# EAGLE design Hall Effect Power (EAGLE 7.6.0)
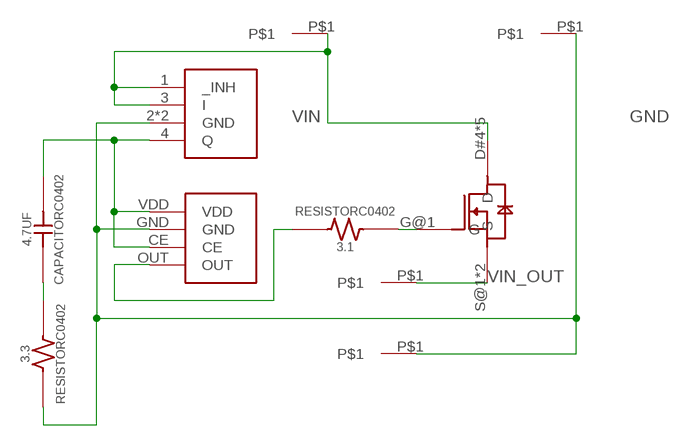
[diagram p0: schematic, sheet 1]

## Parts
3.1  RESISTORC0402  [C0402]
3.3  RESISTORC0402  [C0402]
4.7UF  CAPACITORC0402  [C0402]
U$1  HALL-MOSFET-NEW  [HALL-MOSFET-NEW]
U$2  HALL-HALL-NEW  [HALL-HALL-NEW]
U$3  HALL-REG-NEW  [HALL-REG-NEW]
U$4  SINGLE-WIRE  [SINGLE-WIRE]
U$5  SINGLE-WIRE  [SINGLE-WIRE]
U$6  SINGLE-WIRE  [SINGLE-WIRE]
U$7  SINGLE-WIRE  [SINGLE-WIRE]

## Nets
GND: 3.3.1 U$2.GND U$3.2(GND) U$3.5(GND) U$4.P$1 U$7.P$1
HALL_OUT: 3.1.2 U$2.OUT
N$1: 4.7UF.2(B) U$2.CE U$2.VDD U$3.4(Q)
N$2: 3.3.2 4.7UF.1(A)
N$3: 3.1.1 U$1.G@1(G)
VIN: U$1.D#4(D) U$1.D@1(D) U$1.D@2(D) U$1.D@3(D) U$1.D@5(D) U$3.1(_INH) U$3.3(I) U$6.P$1
VIN_OUT: U$1.S@1(S) U$1.S@2(S) U$5.P$1

## Library data of the parts
3.1 = RocketControlBoard:RESISTOR: SMD Resistor; DESC: RES SMD 470 OHM 5% 1/16W 0402; DIGIKEY#: 1276-4368-1-ND; MANF: Samsung Electro-Mechanics America, Inc.; MANF#: RC1005J471CS
3.3 = RocketControlBoard:RESISTOR: SMD Resistor; DESC: RES SMD 3.3 OHM 5% 1/16W 0402; DIGIKEY#: 311-3.3JRCT-ND; MANF: Yageo; MANF#: RC0402JR-073R3L
4.7UF = RocketControlBoard:CAPACITOR: SMD Capacitor; DESC: CAP CER 4.7UF 10V X5R 0402; DIGIKEY#: 1276-6819-1-ND; MANF: Samsung Electro-Mechanics America, Inc.; MANF#: CL05A475MP7NRB8
U$1 = RocketControlBoard:HALL-MOSFET-NEW; DESC: MOSFET N-CH 40V 30A SC70-6; DIGIKEY#: SIAA40DJ-T1-GE3CT-ND; MANF: Vishay Siliconix; MANF#: SIAA40DJ-T1-GE3
U$2 = RocketControlBoard:HALL-HALL-NEW; DESC: IC HALL EFFECT SENSOR SNT-4A; DIGIKEY#: 1662-1657-1-ND; MANF: SII Semiconductor Corporation; MANF#: S-5724HCBL1-I4T1U
U$3 = RocketControlBoard:HALL-REG-NEW; DESC: IC REG LDO 3.3V 30MA SCT595-5; DIGIKEY#: IFX20001MBV33HTSA1CT-ND; MANF: Infineon Technologies; MANF#: IFX20001MBV33HTSA1
U$4-U$7 = RocketControlBoard:SINGLE-WIRE

## Board
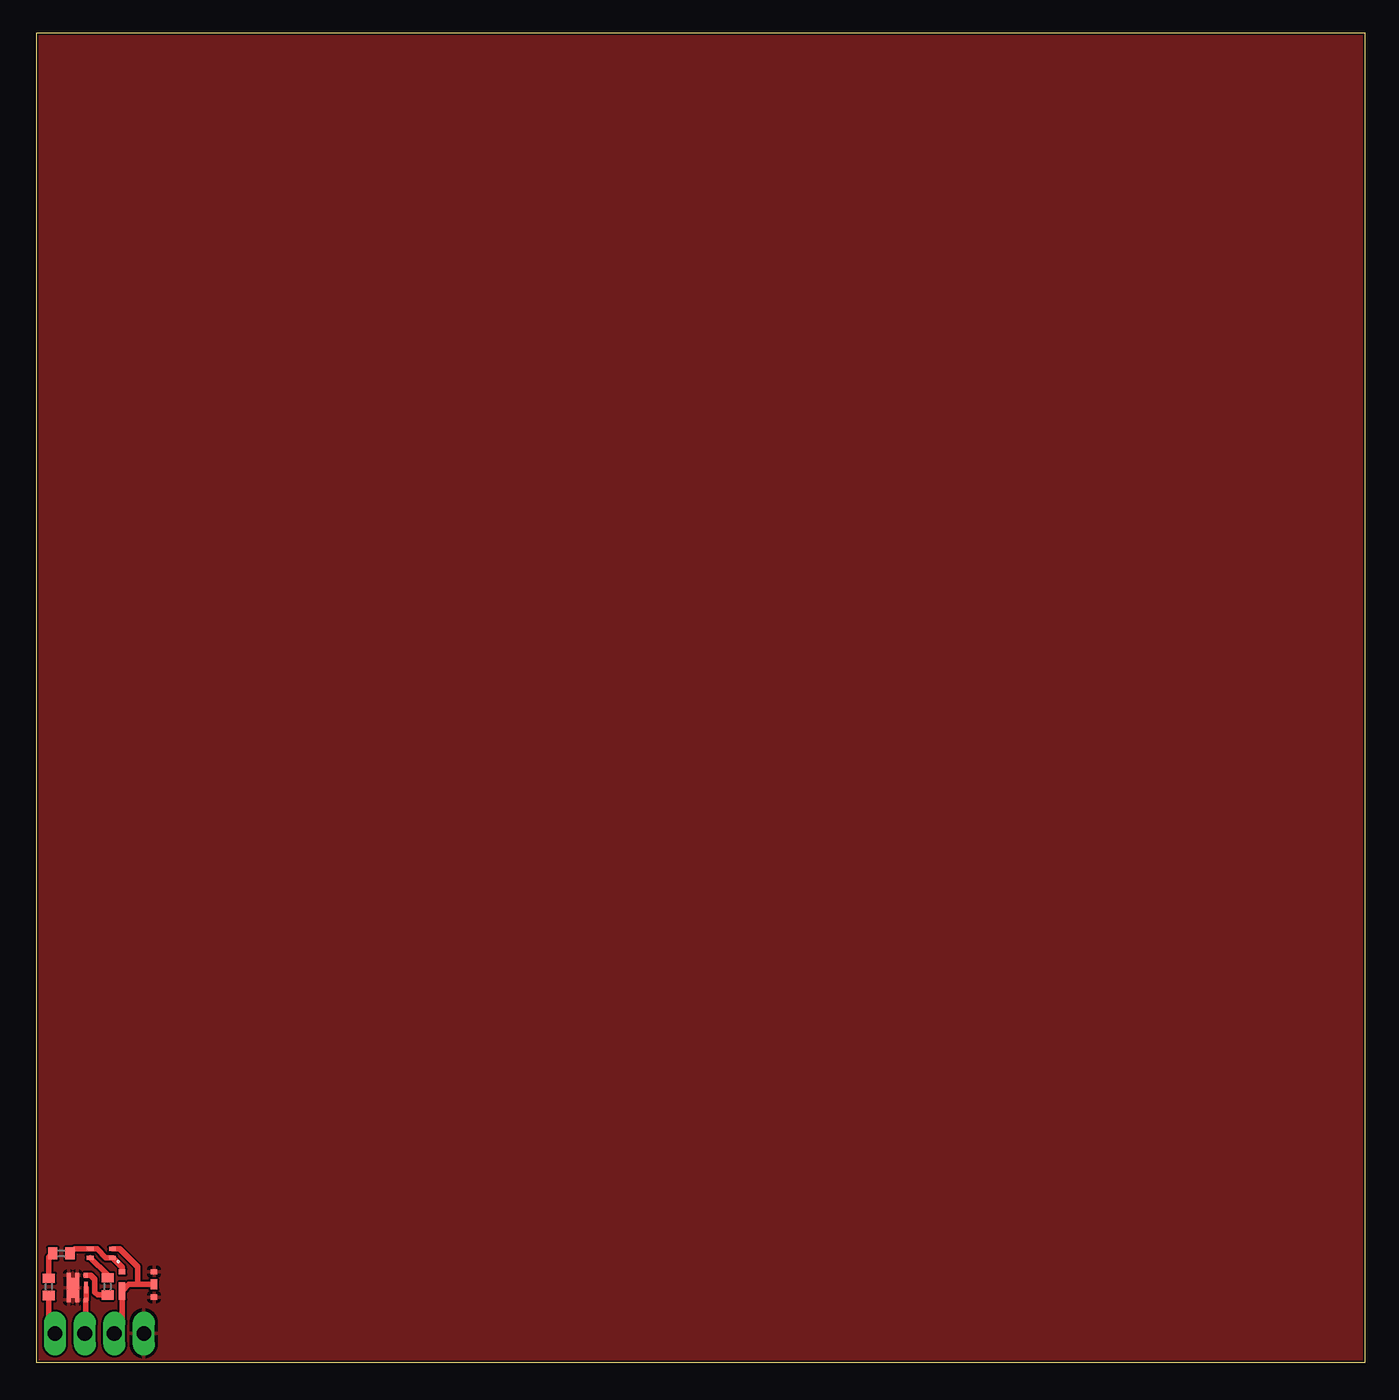
[diagram p1: board, top side]
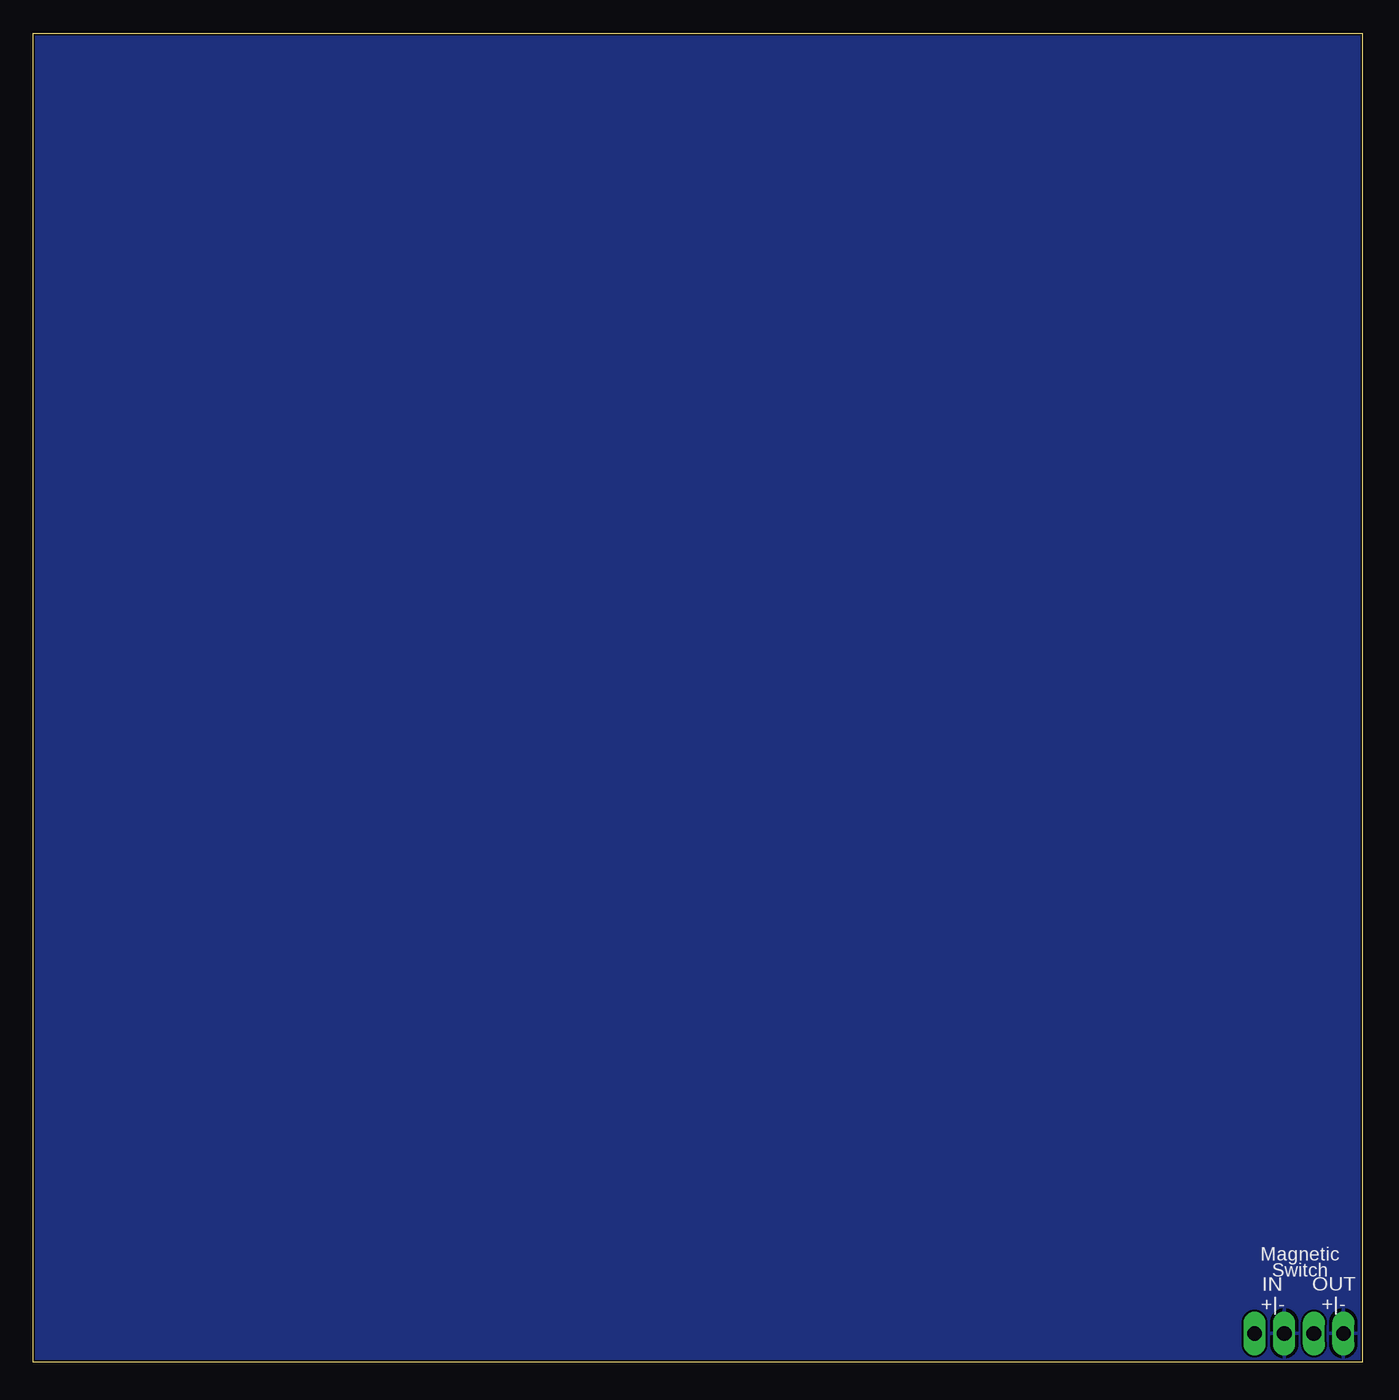
[diagram p2: board, bottom side, seen from below]

Size 100 x 100 mm. Coordinates in mm from the lower left corner, seen from the top.
Outline: 0,0 100,0 100,100 0,100 0,0
Copper layers (1*16): Top 0.035mm / dielectric 1.5mm / Bottom 0.035mm
Design rules "pcbway": minimum track width 6mil, minimum drill 12mil, track to track 6mil, track to pad 6mil, pad to pad 6mil, via to via 6mil, smd to smd 6mil, copper to edge 6mil, drill to drill 6mil, minimum pad ring 10mil, minimum via ring 8mil, stop-mask expansion 4mil, vias tented up to drill 0mil, thermal gap 10mil

### Footprints (pad centres in the part's own frame; a part is rotated, then mirrored left to right if it is on the bottom)
C0402 = smd 0.7 x 0.9: 1 -0.65,0; 2 0.65,0
HALL-MOSFET-NEW = smd 0.3 x 0.35: D#4 0,-0.925; D@2 -0.65,0.925; D@3 0,0.925; D@5 -0.65,-0.925; G@1 0.65,0.925; S@2 0.65,-0.925 | smd 0.95 x 1.5: D@1 -0.325,0 | smd 0.235 x 0.87: S@1 0.667,0
HALL-HALL-NEW = smd 0.3 x 0.52: CE -0.325,-0.84; GND -0.325,0.84; OUT 0.325,-0.84; VDD 0.325,0.84
HALL-REG-NEW = smd 0.4 x 0.5: 1 -0.95,0; 3 0.95,0; 4 0.95,2.4 | smd 0.75 x 0.5: 2 0,0 | smd 1.3 x 0.5: 5 -0.5,2.4
SINGLE-WIRE = drill 1.1 pad 1.27 long: P$1 0,0

### Placement (x,y rotation side)
3.1  5.36,5.7 90 top
3.3  0.94,5.66 90 top
4.7UF  1.88,8.18 0 top
U$1  3.07,5.61 0 top
U$2  4.89,8.2 270 top
U$3  8.85,5.85 90 top
U$4  1.42,2.17 0 top
U$5  3.64,2.17 0 top
U$6  8.09,2.17 0 top
U$7  5.86,2.17 0 top

### Tracks (layer width: path | path; a pad name or v marks a point on that pad's centre or on a via)
GND
  Top 0.406: U$4.P$1 0.94,2.64 3.3.1 | U$7.P$1 6.45,2.76 U$3.5 6.95,5.85 7.75,5.85 | 7.75,5.85 U$3.2 | U$2.GND 6.27,8.52 7.61,7.18 7.61,5.99 7.75,5.85
  pour Bottom: -1,-1 -1,101 101,101 101,-1
HALL_OUT
  Top 0.406: U$2.OUT 5.36,6.57 3.1.2
N$1
  Top 0.406: 4.7UF.2 2.87,8.52 U$2.CE 4.59,8.52 5.24,7.87 U$2.VDD 6.45,7.15 U$3.4
N$2
  Top 0.406: 3.3.2 0.94,7.89 4.7UF.1
N$3
  Top 0.406: U$1.G@1 4.08,6.54 4.39,6.23 4.39,5.27 4.61,5.05 3.1.1
VIN
  pour Top: -2,102 102,102 102,-2 -2,-2
VIN_OUT
  Top 0.406: U$5.P$1 3.72,2.25 U$1.S@2 3.74,4.71 U$1.S@1

### Text on the board
bPlace: Magnetic / Switch
bNames: OUT / +|- | IN / +|-